# Altium project micromouseSHE.PrjPcb
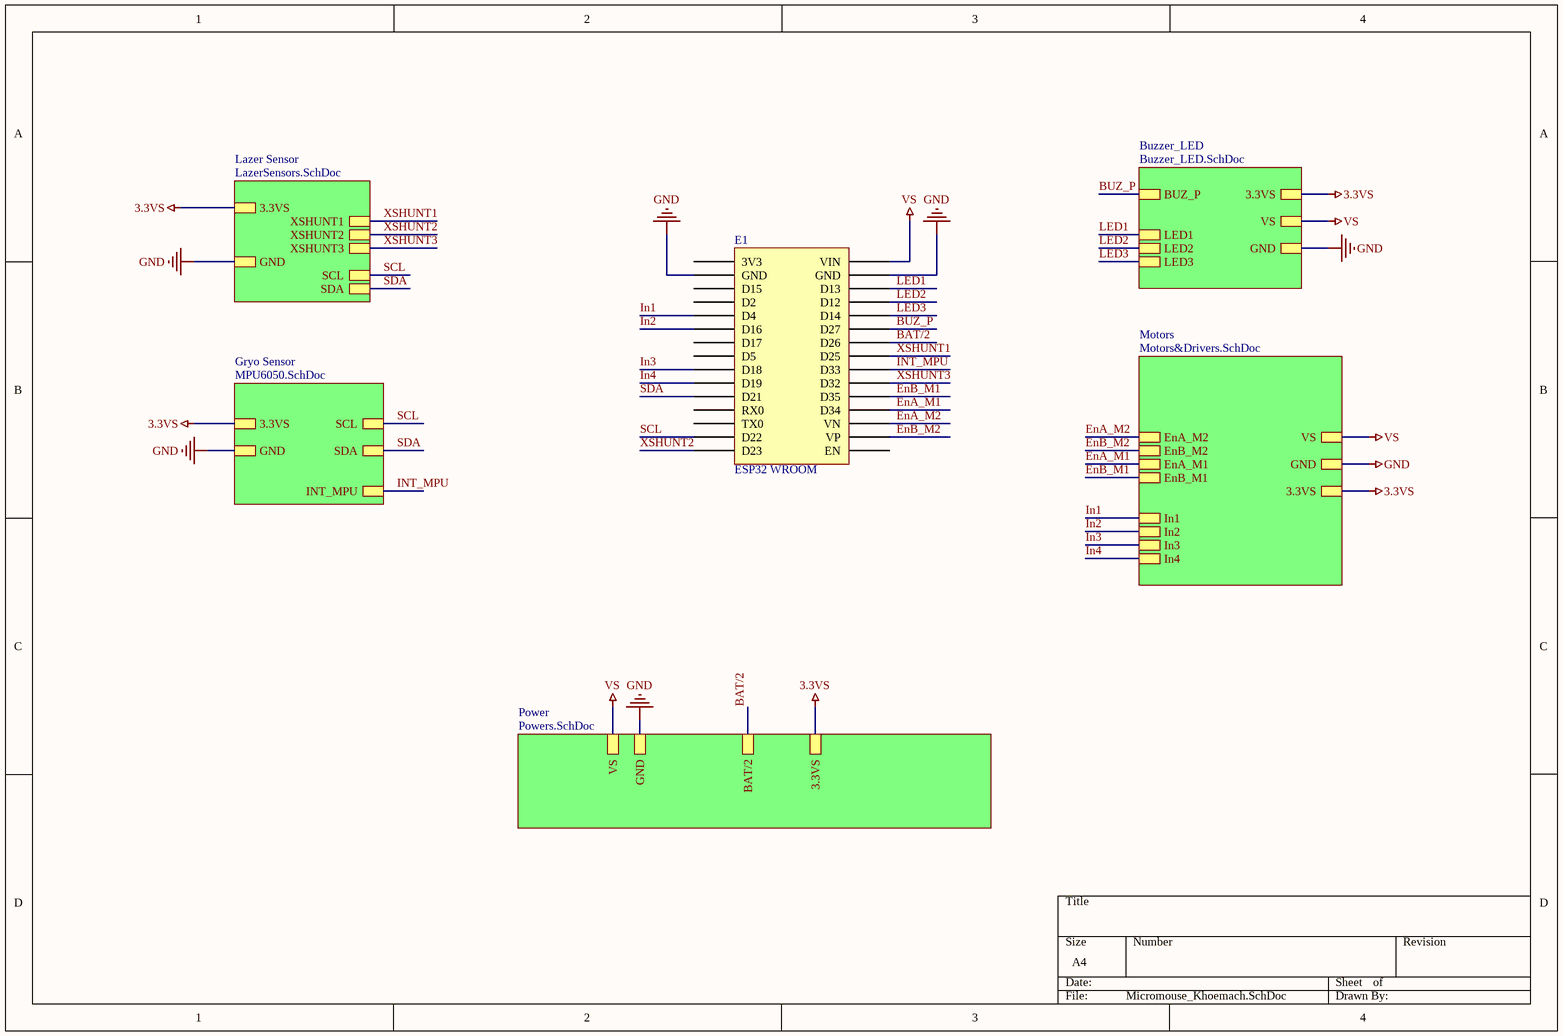
[diagram p0: Micromouse_Khoemach.SchDoc]
title: Micromouse Circuit version 1.0
5 sheets, 14 parts. Net scope: hierarchical (ports join the sheet entries above them; power ports are global).
Board file: PCB.PcbDoc
Sheets:
  Micromouse_Khoemach.SchDoc
    Lazer Sensor = LazerSensors.SchDoc
    Gryo Sensor = MPU6050.SchDoc
    Power = Powers.SchDoc
    Motors = Motors&Drivers.SchDoc

## Sheet Micromouse_Khoemach.SchDoc: Micromouse Circuit version 1.0
size A4; SheetNumber: 1; SheetTotal: 6

### Parts
E1  ESP32 WROOM  [ESP32 WROOM]

### Sub-sheets
Buzzer_LED = Buzzer_LED.SchDoc (file not in this document): BUZ_P, LED1, LED2, LED3, 3.3VS, GND, VS
Gryo Sensor = MPU6050.SchDoc: SDA, SCL, GND, 3.3VS, INT_MPU
Lazer Sensor = LazerSensors.SchDoc: SDA, SCL, GND, 3.3VS, XSHUNT1, XSHUNT2, XSHUNT3
Motors = Motors&Drivers.SchDoc: In1, In2, In3, In4, EnA_M1, EnA_M2, EnB_M1, EnB_M2, VS, GND, 3.3VS
Power = Powers.SchDoc: VS, GND, BAT/2, 3.3VS

### Nets
3.3VS: sheet Lazer Sensor/3.3VS, sheet Gryo Sensor/3.3VS, sheet Power/3.3VS, sheet Motors/3.3VS, sheet Buzzer_LED/3.3VS
GND: E1.GND ; sheet Lazer Sensor/GND, sheet Gryo Sensor/GND, sheet Power/GND, sheet Motors/GND, sheet Buzzer_LED/GND
VS: E1.VIN ; sheet Power/VS, sheet Motors/VS, sheet Buzzer_LED/VS
BAT/2: E1.D26 ; sheet Power/BAT/2
BUZ_P: E1.D27 ; sheet Buzzer_LED/BUZ_P
EnA_M1: E1.D34 ; sheet Motors/EnA_M1
EnA_M2: E1.VN ; sheet Motors/EnA_M2
EnB_M1: E1.D35 ; sheet Motors/EnB_M1
EnB_M2: E1.VP ; sheet Motors/EnB_M2
In1: E1.D4 ; sheet Motors/In1
In2: E1.D16 ; sheet Motors/In2
In3: E1.D18 ; sheet Motors/In3
In4: E1.D19 ; sheet Motors/In4
INT_MPU: E1.D33 ; sheet Gryo Sensor/INT_MPU
LED1: E1.D13 ; sheet Buzzer_LED/LED1
LED2: E1.D12 ; sheet Buzzer_LED/LED2
LED3: E1.D14 ; sheet Buzzer_LED/LED3
SCL: E1.D22 ; sheet Lazer Sensor/SCL, sheet Gryo Sensor/SCL
SDA: E1.D21 ; sheet Lazer Sensor/SDA, sheet Gryo Sensor/SDA
XSHUNT1: E1.D25 ; sheet Lazer Sensor/XSHUNT1
XSHUNT2: E1.D23 ; sheet Lazer Sensor/XSHUNT2
XSHUNT3: E1.D32 ; sheet Lazer Sensor/XSHUNT3

Not connected (* = marked no-connect by the designer): E1 3V3 D2 D5 D15 D17 EN RX0 TX0

## Sheet LazerSensors.SchDoc: Micromouse Circuit version 1.0
size A3; SheetNumber: 2; SheetTotal: 6
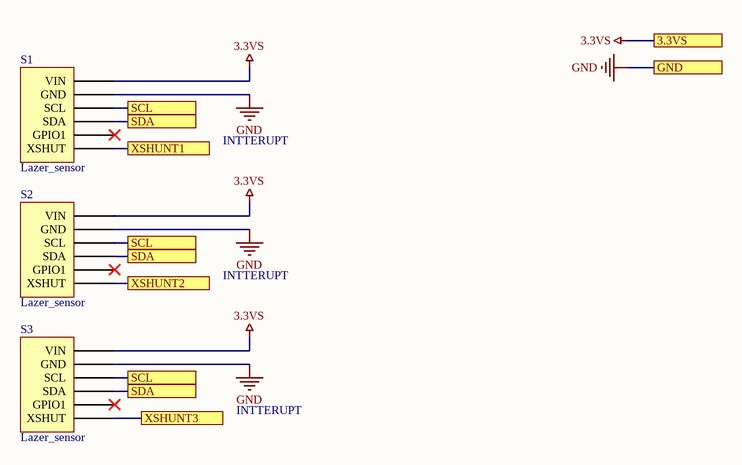
[diagram p1: LazerSensors.SchDoc]

### Parts
S1  Lazer_sensor  [Lazer_Sensor]
S2  Lazer_sensor  [Lazer_Sensor]
S3  Lazer_sensor  [Lazer_Sensor]

### Ports
3.3VS, GND, SCL, SDA, XSHUNT1, XSHUNT2, XSHUNT3

### Nets
3.3VS: S1.1(VIN) S2.1(VIN) S3.1(VIN) ; port 3.3VS
GND: S1.2(GND) S2.2(GND) S3.2(GND) ; port GND
SCL: S1.3(SCL) S2.3(SCL) S3.3(SCL) ; port SCL
SDA: S1.4(SDA) S2.4(SDA) S3.4(SDA) ; port SDA
XSHUNT1: S1.6(XSHUT) ; port XSHUNT1
XSHUNT2: S2.6(XSHUT) ; port XSHUNT2
XSHUNT3: S3.6(XSHUT) ; port XSHUNT3

Not connected (* = marked no-connect by the designer): S1 5(GPIO1)*; S2 5(GPIO1)*; S3 5(GPIO1)*

### Notes on the sheet
- INTTERUPT

### Library data of the parts
S1-S3 = Lazer_sensor: VL53L0X (ToF-F) 940nm GY-VL53L0XV2 I2C

## Sheet MPU6050.SchDoc: Micromouse Circuit version 1.0
size A3; SheetNumber: 3; SheetTotal: 6
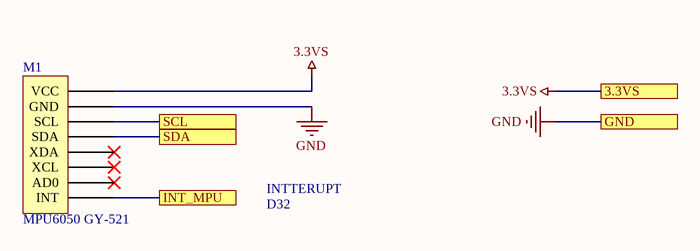
[diagram p2: MPU6050.SchDoc]

### Parts
M1  MPU6050 GY-521  [MPU6050 GY-521]

### Ports
3.3VS, GND, INT_MPU, SCL, SDA

### Nets
3.3VS: M1.1(VCC) ; port 3.3VS
GND: M1.2(GND) ; port GND
INT_MPU: M1.8(INT) ; port INT_MPU
SCL: M1.3(SCL) ; port SCL
SDA: M1.4(SDA) ; port SDA

Not connected (* = marked no-connect by the designer): M1 5(XDA)* 6(XCL)* 7(AD0)*

### Notes on the sheet
- INTTERUPT
- D32

### Library data of the parts
M1 = MPU6050 GY-521: Module

## Sheet Powers.SchDoc: Micromouse Circuit version 1.0
size A3; SheetNumber: 4; SheetTotal: 6
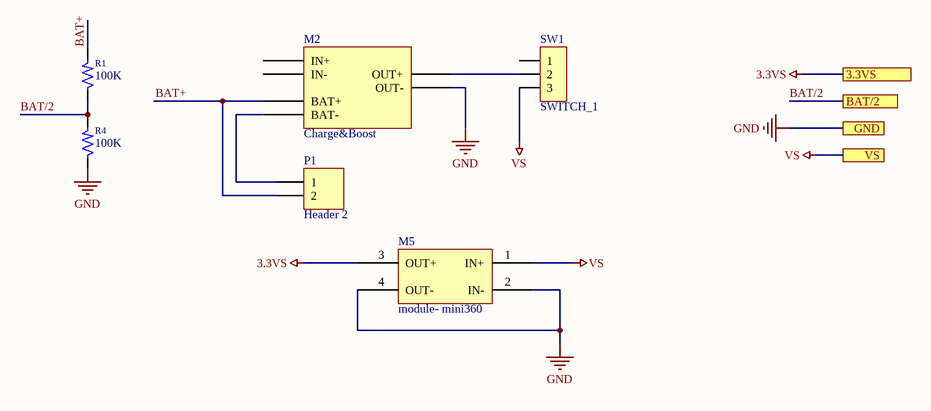
[diagram p3: Powers.SchDoc]

### Parts
M2  Charge&Boost  [Charge&Boost]
M5  module- mini360  [MODULE-MINI360]
P1  Header 2  [HDR1X2]
R1  100K  [RESC2012X70N]
R4  100K  [RESC2012X70N]
SW1  SWITCH_1  [SWITCH]

### Ports
3.3VS, BAT/2, GND, VS

### Nets
3.3VS: M5.3(OUT+) ; port 3.3VS
GND: M2.OUT- M5.2(IN-) M5.4(OUT-) R4.1 ; port GND
VS: M5.1(IN+) SW1.3 ; port VS
BAT+: M2.BAT+ P1.2 R1.2
BAT/2: R1.1 R4.2 ; port BAT/2
NetM2_BAT-: M2.BAT- P1.1
NetM2_OUT+: M2.OUT+ SW1.2

Not connected (* = marked no-connect by the designer): M2 IN+ IN-; SW1 1

### Library data of the parts
P1 = Header 2: Header, 2-Pin; LatestRevisionDate: 17-Jul-2002; LatestRevisionNote: Re-released for DXP Platform.; Publisher: Altium Limited
R1 R4 = Res SMD: Res 0805

## Sheet Motors&Drivers.SchDoc: Micromouse Circuit version 1.0
size A3; SheetNumber: 5; SheetTotal: 6
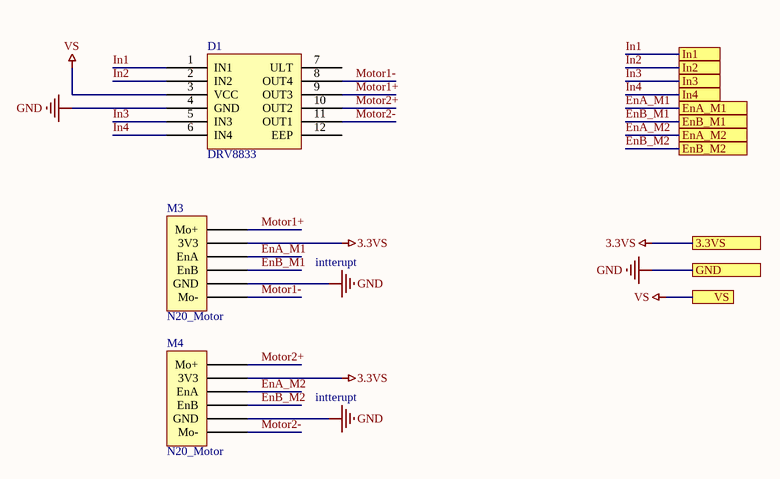
[diagram p4: Motors&Drivers.SchDoc]

### Parts
D1  DRV8833  [DRV8833]
M3  N20_Motor  [Header_N20_Motor]
M4  N20_Motor  [Header_N20_Motor]

### Ports
3.3VS, EnA_M1, EnA_M2, EnB_M1, EnB_M2, GND, In1, In2, In3, In4, VS

### Nets
3.3VS: M3.3V3 M4.3V3 ; port 3.3VS
GND: D1.4(GND) M3.GND M4.GND ; port GND
VS: D1.3(VCC) ; port VS
EnA_M1: M3.EnA ; port EnA_M1
EnA_M2: M4.EnA ; port EnA_M2
EnB_M1: M3.EnB ; port EnB_M1
EnB_M2: M4.EnB ; port EnB_M2
In1: D1.1(IN1) ; port In1
In2: D1.2(IN2) ; port In2
In3: D1.5(IN3) ; port In3
In4: D1.6(IN4) ; port In4
Motor1+: D1.9(OUT3) M3.Mo+
Motor1-: D1.8(OUT4) M3.Mo-
Motor2+: D1.10(OUT2) M4.Mo+
Motor2-: D1.11(OUT1) M4.Mo-

Not connected (* = marked no-connect by the designer): D1 7(ULT) 12(EEP)

### Notes on the sheet
- intterupt

### Library data of the parts
D1 = DRV8833: Module

## Nets that join several sheets
3.3VS: LazerSensors (S1.1 S2.1 S3.1), MPU6050 (M1.1), Powers (M5.3), Motors&Drivers (M3.3V3 M4.3V3)
GND: Micromouse_Khoemach (E1.GND), LazerSensors (S1.2 S2.2 S3.2), MPU6050 (M1.2), Powers (M2.OUT- M5.2 M5.4 R4.1), Motors&Drivers (D1.4 M3.GND M4.GND)
VS: Micromouse_Khoemach (E1.VIN), Powers (M5.1 SW1.3), Motors&Drivers (D1.3)
BAT/2: Micromouse_Khoemach (E1.D26), Powers (R1.1 R4.2)
EnA_M1: Micromouse_Khoemach (E1.D34), Motors&Drivers (M3.EnA)
EnA_M2: Micromouse_Khoemach (E1.VN), Motors&Drivers (M4.EnA)
EnB_M1: Micromouse_Khoemach (E1.D35), Motors&Drivers (M3.EnB)
EnB_M2: Micromouse_Khoemach (E1.VP), Motors&Drivers (M4.EnB)
In1: Micromouse_Khoemach (E1.D4), Motors&Drivers (D1.1)
In2: Micromouse_Khoemach (E1.D16), Motors&Drivers (D1.2)
In3: Micromouse_Khoemach (E1.D18), Motors&Drivers (D1.5)
In4: Micromouse_Khoemach (E1.D19), Motors&Drivers (D1.6)
INT_MPU: Micromouse_Khoemach (E1.D33), MPU6050 (M1.8)
SCL: Micromouse_Khoemach (E1.D22), LazerSensors (S1.3 S2.3 S3.3), MPU6050 (M1.3)
SDA: Micromouse_Khoemach (E1.D21), LazerSensors (S1.4 S2.4 S3.4), MPU6050 (M1.4)
XSHUNT1: Micromouse_Khoemach (E1.D25), LazerSensors (S1.6)
XSHUNT2: Micromouse_Khoemach (E1.D23), LazerSensors (S2.6)
XSHUNT3: Micromouse_Khoemach (E1.D32), LazerSensors (S3.6)